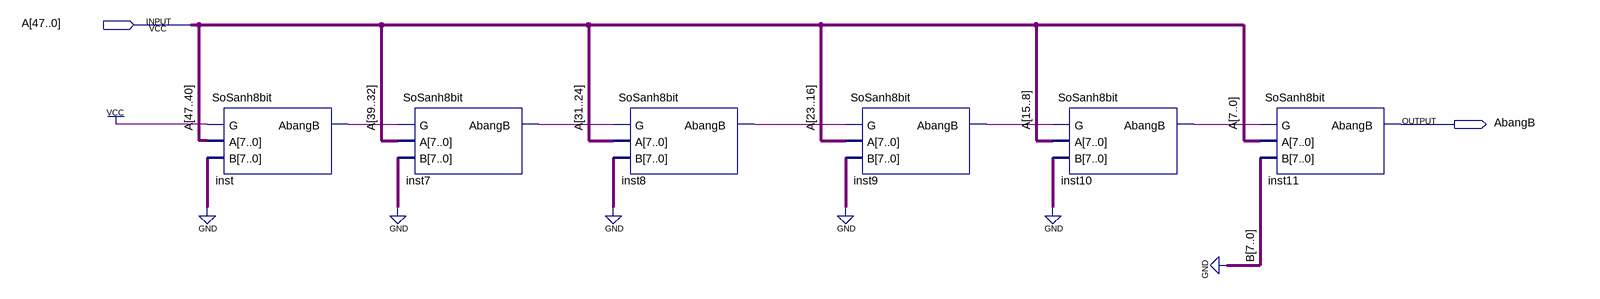
[diagram p0: schematic sheet]
// Quartus schematic SoSanhBang48bit.bdf as structural Verilog: 6 symbols, 2 pins
module SoSanhBang48bit (
  input  [47:0] A,
  output AbangB
);

  wire inst7_abangb, inst8_abangb, inst9_abangb, inst10_abangb, inst_abangb;

  SoSanh8bit inst (.G(1'b1), .A(A[47:40]), .B({8{1'b0}}), .AbangB(inst_abangb));
  SoSanh8bit inst7 (.G(inst_abangb), .A(A[39:32]), .B({8{1'b0}}), .AbangB(inst7_abangb));
  SoSanh8bit inst8 (.G(inst7_abangb), .A(A[31:24]), .B({8{1'b0}}), .AbangB(inst8_abangb));
  SoSanh8bit inst9 (.G(inst8_abangb), .A(A[23:16]), .B({8{1'b0}}), .AbangB(inst9_abangb));
  SoSanh8bit inst10 (.G(inst9_abangb), .A(A[15:8]), .B({8{1'b0}}), .AbangB(inst10_abangb));
  SoSanh8bit inst11 (.G(inst10_abangb), .A(A[7:0]), .B({8{1'b0}}), .AbangB(AbangB));
endmodule
